# EasyEDA schematic SISPRAV1.json
TITLE: SIRIN V.1; REV: 1.0; Date: 2018-05-17; Sheet: 1/1; Drawn By: FelipheGomez
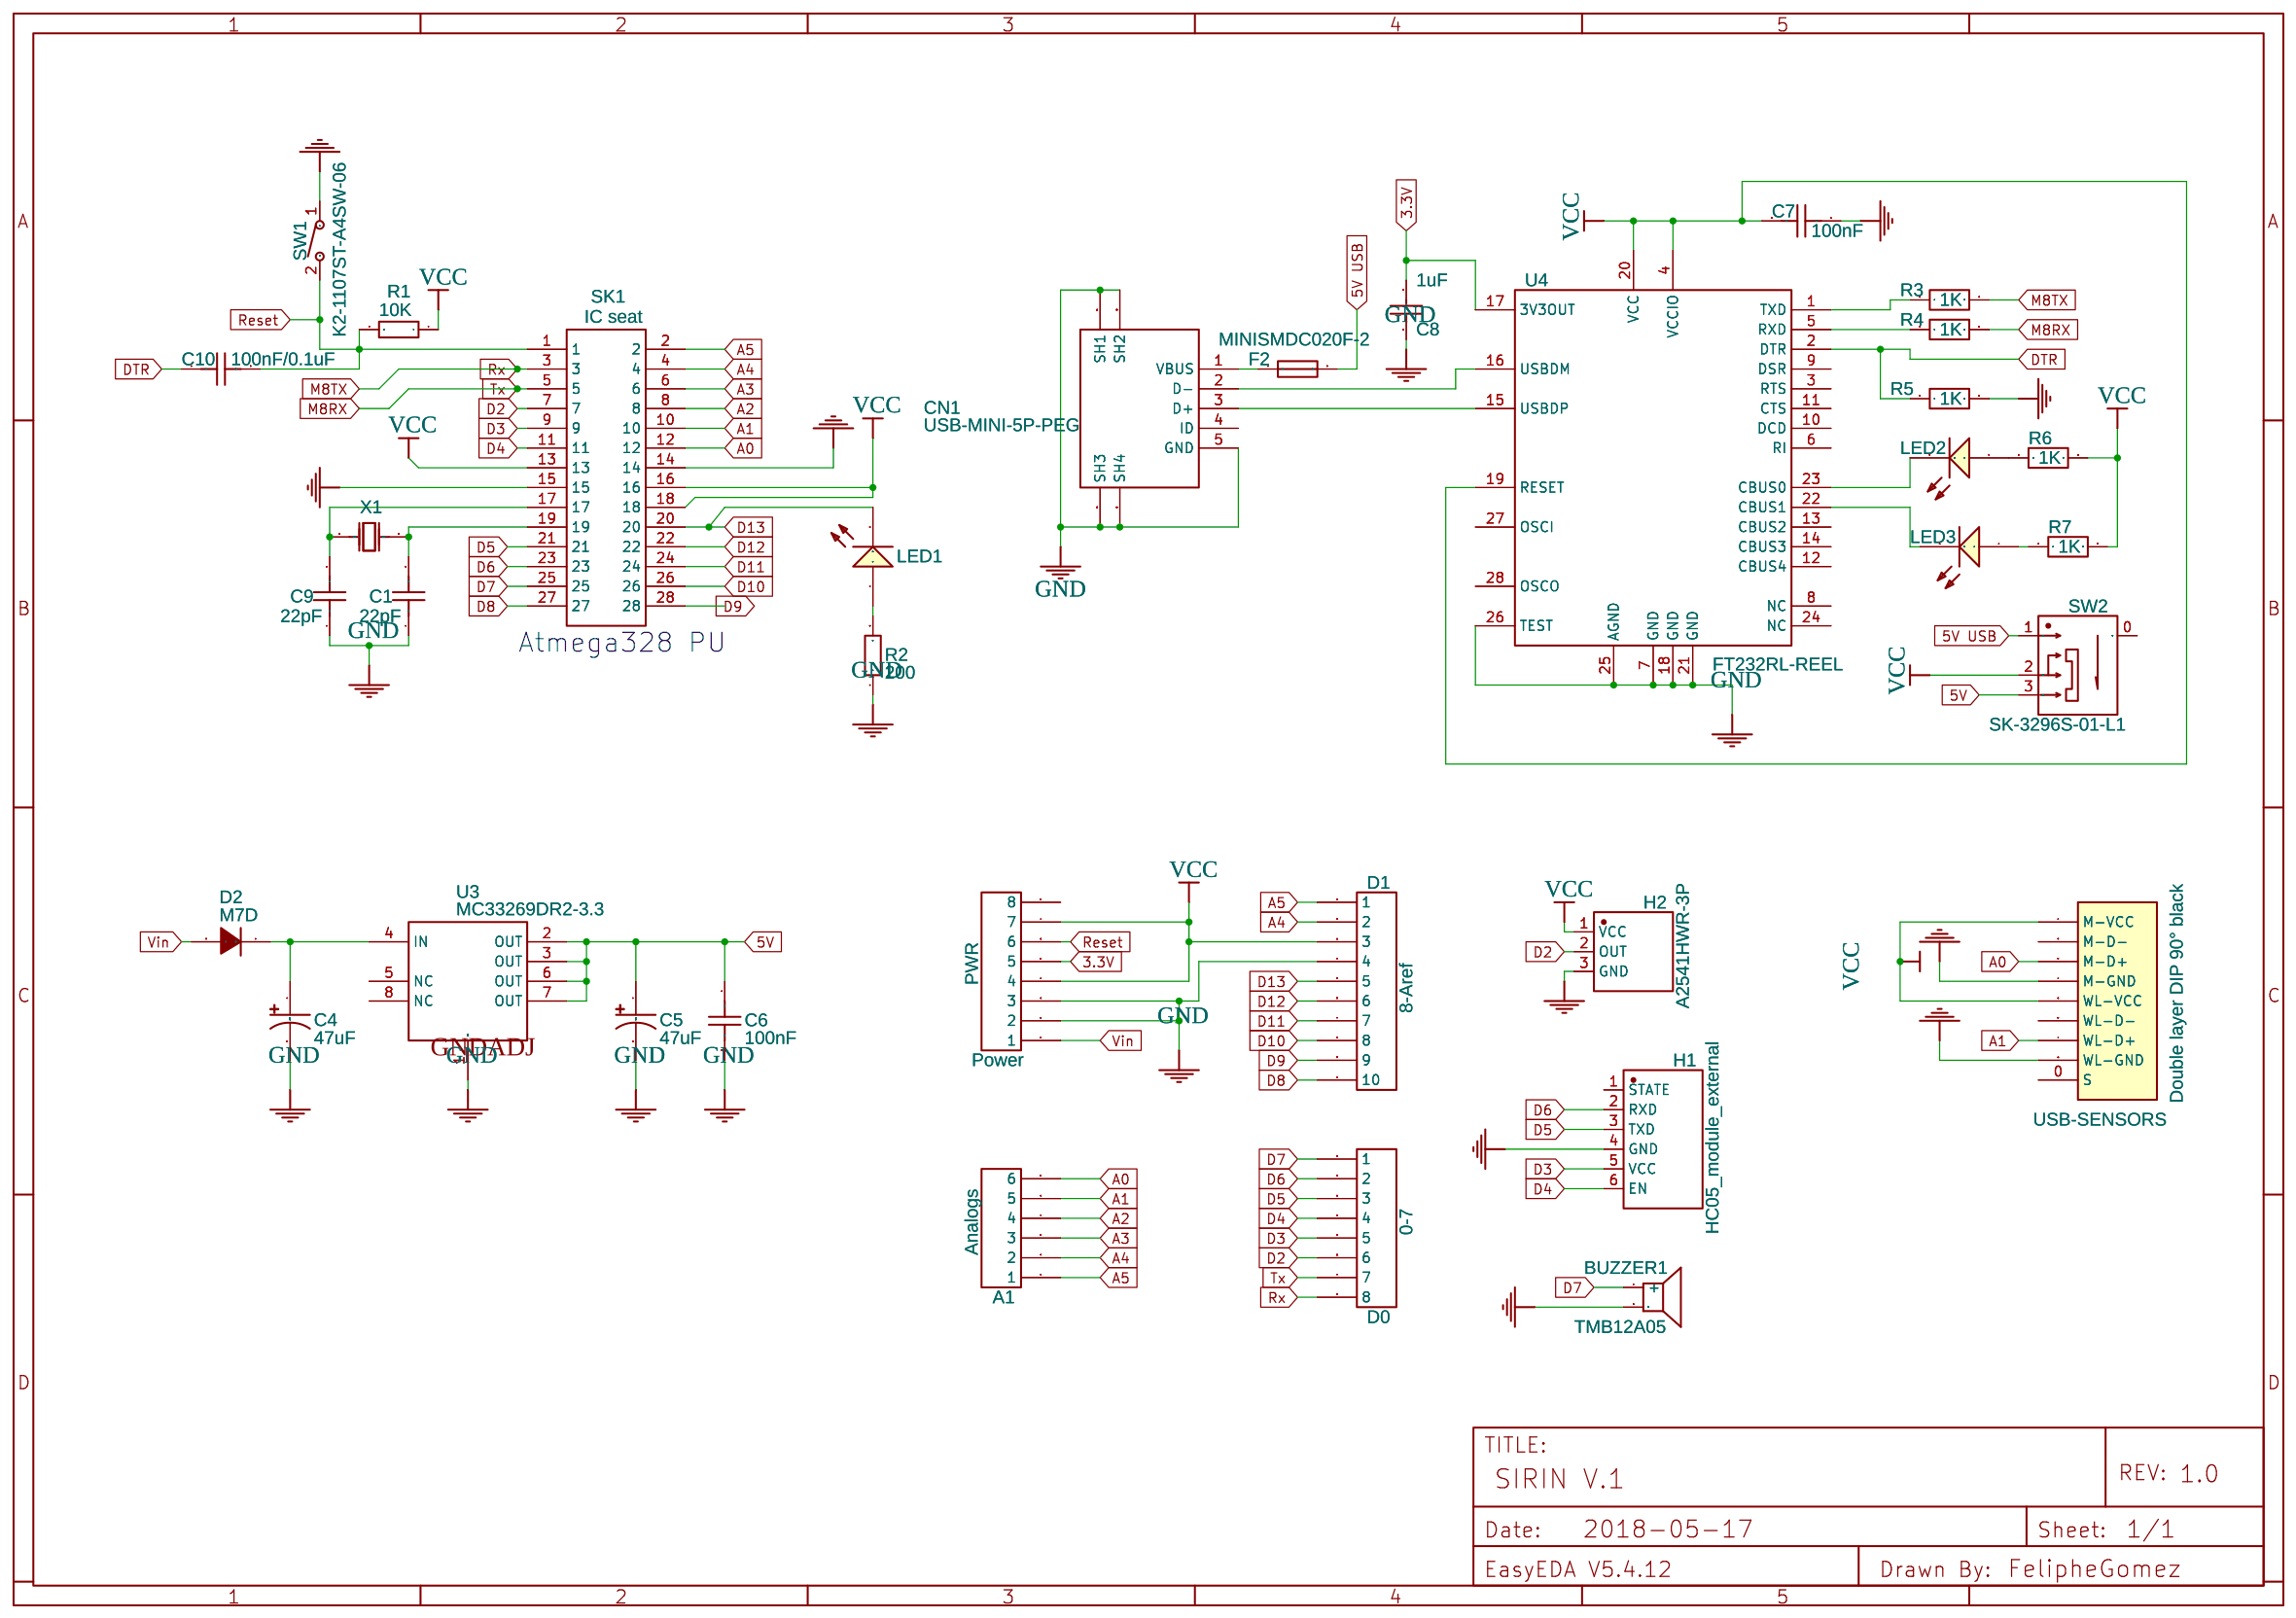
[diagram p0: schematic sheet]

## Parts
A1  Analogs  [HDR-6X1/2.54]
BUZZER1  TMB12A05  [B-12*7.5]
C1  22pF  [0805]
C4  47uF  [CAP-SMD_BD8.0-L8.3-W8.3-FD]
C5  47uF  [CAP-SMD_BD8.0-L8.3-W8.3-FD]
C6  100nF  [0805]
C7  100nF  [0805]
C8  1uF  [0805]
C9  22pF  [0805]
C10  100nF/0.1uF  [0402]
CN1  USB-MINI-5P-PEG  [MINI-USB-B-SMD_5PIN-FEMALE_MINI-5P-PEG]
D0  0-7  [HDR-8X1/2.54]
D1  8-Aref  [HDR-10X1/2.54]
D2  M7D  [SMA_L4.4-W2.6-LS5.0-RD]
F2  MINISMDC020F-2  [1812]
H1  HC05_module_external  [HDR-TH_6P-P2.54-H-W8.6_A2541HWR-6P]
H2  A2541HWR-3P  [A2541HWR-3P]
LED1  17-21/GHC-YR1S2/3T  [LED-0805]
LED2  17-21/GHC-YR1S2/3T  [LED-0805]
LED3  17-21/GHC-YR1S2/3T  [LED-0805]
PWR  Power  [HDR-8X1/2.54]
R1  10K  [0805]
R2  200  [0805]
R3  1K  [R0603]
R4  1K  [R0603]
R5  1K  [R0603]
R6  1K  [R0603]
R7  1K  [R0603]
SK1  IC seat  [DIP-28_L36.0-W10.2-P2.54-LS10.2-BL]
SW1  K2-1107ST-A4SW-06  [K2-1107ST-A4SW-06]
SW2  SK-3296S-01-L1  [SW-SMD-C8.4X4.3]
U3  MC33269DR2-3.3  [SOIC-8_150MIL]
U4  FT232RL-REEL  [SSOP-28_L10.2-W5.3-P0.65-LS7.8-BL]
USB-SENSORS  Double layer DIP 90° black  [USB-M-51]
X1  16MHZ  [OSC-49S-1]

## Library data of the parts
A1 = -: Supplier: LCSC; Manufacturer: BOOMELE; Manufacturer Part: Header-Male-2.54_1x6; Supplier Part: C37208
BUZZER1 = -: Supplier: LCSC; Manufacturer: HNDZ; Supplier Part: C96093
C1 C9 = 0805CG220J500NT: Supplier: LCSC; Manufacturer: FH; Supplier Part: C24658
C4 C5 = EEEHD1E470AP: Supplier: LCSC; Supplier Part: C401849; Manufacturer: PANASONIC; Contributor: LCSC
C6 C7 = AC0805KRX7R9BB104: Supplier: LCSC; Supplier Part: C277502; Manufacturer: YAGEO; Contributor: LCSC
C8 = CC0805ZKY5V9BB105: Supplier: LCSC; Manufacturer: YAGEO; Supplier Part: C106838
C10 = GRM155R71C104KA88D: Supplier: LCSC; Manufacturer: MuRata; Supplier Part: C71629
CN1 = -: Supplier: LCSC; Manufacturer: ValuePro; image: //image.lceda.cn/szlcsc/C69074.jpg; Supplier Part: C69074
D0 PWR = -: Supplier: LCSC; Manufacturer: ReliaPro; Manufacturer Part: Header2.54mm 1*8P; image: http://image.lceda.cn/szlcsc/C49256.jpg
D1 = -: Supplier: LCSC; Manufacturer: ReliaPro; Manufacturer Part: Headers  Pins2.54mm1*10P; image: http://image.lceda.cn/szlcsc/C57369.jpg
D2 = -: Supplier: LCSC; Manufacturer: SEMTECH; Supplier Part: C83913; LCSC Assembly: Yes; SMT Type: Extend
F2 = -: Supplier: LCSC; Supplier Part: C5418; Manufacturer: Littelfuse; Contributor: LCSC
H1 = -: Supplier: LCSC; Supplier Part: C225514; Manufacturer: Changjiang Connectors; Manufacturer Part: A2541HWR-6P; Contributor: LCSC
H2 = -: Supplier: LCSC; Supplier Part: C225511; Manufacturer: Changjiang Connectors; Contributor: LCSC
LED1-LED3 = -: Supplier: EasyEDA; Manufacturer: EVERLIGHT; Supplier Part: E73546
R1 = 0805W8F1002T5E: Supplier: LCSC; Manufacturer: UniOhm; LCSC Assembly: Yes; Supplier Part: C17414; SMT Type: Basic
R2 = ARG05FTC2000: Supplier: LCSC; Supplier Part: C218416; Manufacturer: Viking Tech; Contributor: LCSC
R3-R7 = WR06X102 JTL: Supplier: LCSC; Supplier Part: C384295; Manufacturer: Walsin Tech Corp; Contributor: LCSC
SK1 = -: Supplier: LCSC; Supplier Part: C16653; Manufacturer: Boom Precision Elec; Contributor: LCSC
SW1 = -: Supplier: LCSC; Supplier Part: C118141; Manufacturer: Rectangular Connectors - Contacts; Contributor: LCSC
SW2 = -: Supplier: LCSC; Supplier Part: C319020; Manufacturer: XKB Enterprise; Contributor: LCSC
U3 = -: Supplier: LCSC; Manufacturer: ON; image: //image.lceda.cn/szlcsc/C7301.jpg; Supplier Part: C7301
U4 = -: Supplier: LCSC; Manufacturer: FTDI; LCSC Assembly: Yes; image: //image.lceda.cn/szlcsc/C8690.jpg; Supplier Part: C8690; SMT Type: Basic
USB-SENSORS = -: Supplier: LCSC; Manufacturer: ValuePro; image: //image.lceda.cn/szlcsc/C12049.jpg; Supplier Part: C12049
X1 = -: Supplier: LCSC; Manufacturer: YXC; Manufacturer Part: X49SD16MSD2SC; Supplier Part: C16212

## Nets
3.3V: C8.2 PWR.5 U4.17(3V3OUT)
5V: C5.1 C6.1 SW2.3 U3.2(OUT) U3.3(OUT) U3.6(OUT) U3.7(OUT)
5V USB: F2.2 SW2.1
GND: BUZZER1.2 C1.1 C4.2 C5.2 C6.2 C7.1 C8.1 C9.1 CN1.5(GND) CN1.SH1 CN1.SH2 CN1.SH3 CN1.SH4 D1.4 H1.4(GND) H2.3(GND) PWR.2 PWR.3 R2.1 R5.2 SK1.14 SK1.15 SW1.1 U3.1(GNDADJ) U4.7(GND) U4.18(GND) U4.21(GND) U4.25(AGND) U4.26(TEST) USB-SENSORS.4(M-GND) USB-SENSORS.8(WL-GND)
VCC: C7.2 D1.3 H2.1(VCC) PWR.4 PWR.7 R1.1 R6.2 R7.2 SK1.13 SK1.16 SK1.18 SW2.2 U4.4(VCCIO) U4.19(RESET) U4.20(VCC) USB-SENSORS.1(M-VCC) USB-SENSORS.5(WL-VCC)
Vin: D2.2(A) PWR.1
A0: A1.6 SK1.12 USB-SENSORS.3(M-D+)
A1: A1.5 SK1.10 USB-SENSORS.7(WL-D+)
A2: A1.4 SK1.8
A3: A1.3 SK1.6
A4: A1.2 D1.2 SK1.4
A5: A1.1 D1.1 SK1.2
D2: D0.6 H2.2(OUT) SK1.7
D3: D0.5 H1.5(VCC) SK1.9
D4: D0.4 H1.6(EN) SK1.11
D5: D0.3 H1.3(TXD) SK1.21
D6: D0.2 H1.2(RXD) SK1.23
D7: BUZZER1.1(+) D0.1 SK1.25
D8: D1.10 SK1.27
D9: D1.9 SK1.28
D10: D1.8 SK1.26
D11: D1.7 SK1.24
D12: D1.6 SK1.22
D13: D1.5 LED1.2(C) SK1.20
DTR: C10.1 R5.1 U4.2(DTR)
M8RX: D0.7 R4.2 SK1.5
M8TX: D0.8 R3.2 SK1.3
Reset: C10.2 PWR.6 R1.2 SK1.1 SW1.2
Net-(C1-2): C1.2 SK1.19 X1.1(OSC1)
Net-(C4-1): C4.1 D2.1(C) U3.4(IN)
Net-(C9-2): C9.2 SK1.17 X1.2(OSC2)
Net-(CN1-1): CN1.1(VBUS) F2.1
Net-(CN1-2): CN1.2(D-) U4.16(USBDM)
Net-(CN1-3): CN1.3(D+) U4.15(USBDP)
Net-(LED1-1): LED1.1(A) R2.2
Net-(LED2-1): LED2.1(A) R6.1
Net-(LED2-2): LED2.2(C) U4.23(CBUS0)
Net-(LED3-1): LED3.1(A) R7.1
Net-(LED3-2): LED3.2(C) U4.22(CBUS1)
Net-(R3-1): R3.1 U4.1(TXD)
Net-(R4-1): R4.1 U4.5(RXD)

Not connected (* = marked no-connect by the designer): CN1 4(ID); H1 1(STATE); PWR 8; SW2 0; U3 5(NC) 8(NC); U4 3(RTS) 6(RI) 8(NC) 9(DSR) 10(DCD) 11(CTS) 12(CBUS4) 13(CBUS2) 14(CBUS3) 24(NC) 27(OSCI) 28(OSCO); USB-SENSORS 0(S) 2(M-D-) 6(WL-D-)

## Notes on the sheet
- Atmega328 PU
